# Altium schematic sheet napajeni.SchDoc
size A4
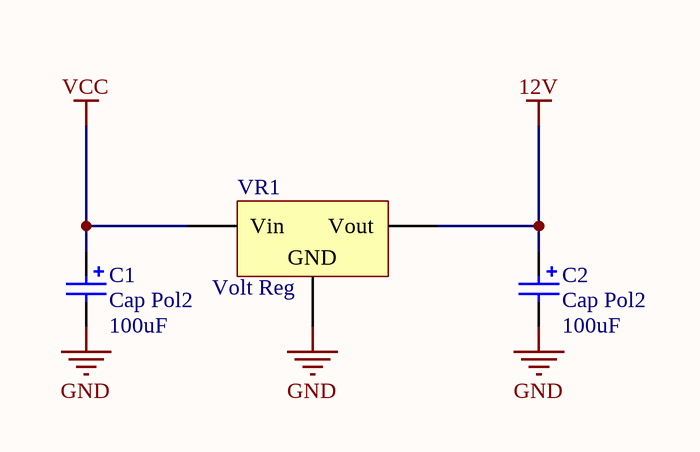
[diagram p0: napajeni.SchDoc]

## Parts
C1  Cap Pol2  value 100uF  [POLAR0.8]
C2  Cap Pol2  value 100uF  [POLAR0.8]
VR1  Volt Reg  [D2PAK_N]

## Nets
12V: C2.1 VR1.3(Vout)
GND: C1.2 C2.2 VR1.2(GND)
VCC: C1.1 VR1.1(Vin)

## Library data of the parts
C1 C2 = Cap Pol2: Polarized Capacitor (Axial); Published: 8-Jun-2000; LatestRevisionDate: 17-Jul-2002; LatestRevisionNote: Re-released for DXP Platform.; PackageReference: POLAR0.8; Publisher: Altium Limited; PackageDescription: Polarized Capacitor; 2 Leads
VR1 = Volt Reg: Voltage Regulator; Published: 24-Mar-1999; LatestRevisionDate: 29-May-2009; LatestRevisionNote: IPC-7351 Footprint Added.; PackageReference: D2PAK; Publisher: Altium Limited; PackageDescription: 3-Pin Transistor Outline Package 2.54 mm Pitch, 15.1 mm Lead Span